# Altium project programmer.PrjPCB
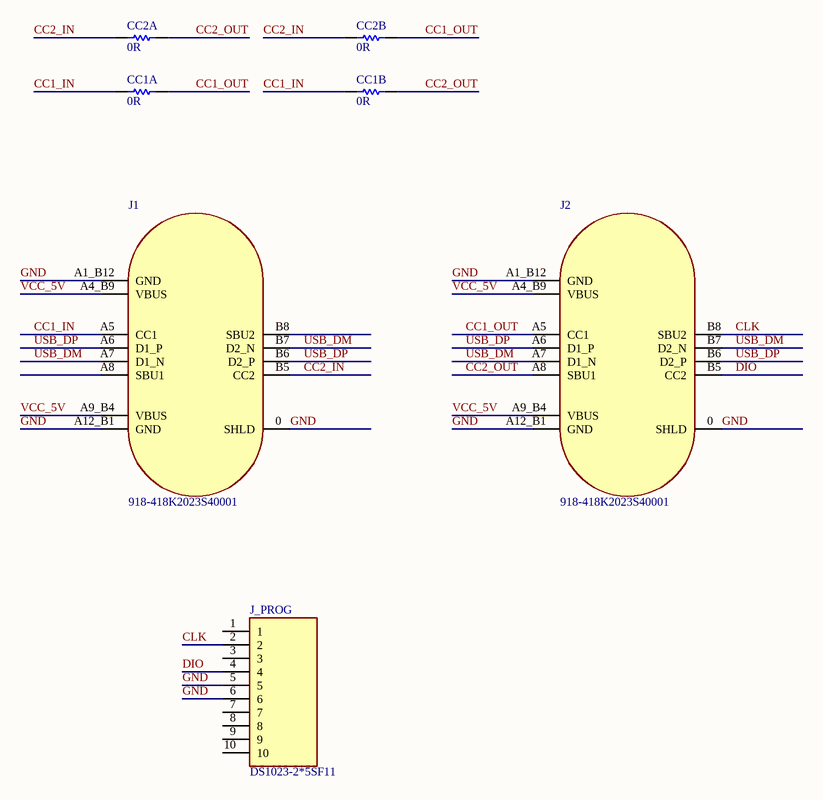
[diagram p0: programmer.SchDoc]
1 sheet, 7 parts. Net scope: global (net labels, ports and power ports of the same name join across sheets).
Board file: programmer.PcbDoc

## Sheet programmer.SchDoc
size A

### Parts
CC1A  value 0R  [R_0402]  (hidden comment: 0402WGF0000TCE)
CC1B  value 0R  [R_0402]  (hidden comment: 0402WGF0000TCE)
CC2A  value 0R  [R_0402]  (hidden comment: 0402WGF0000TCE)
CC2B  value 0R  [R_0402]  (hidden comment: 0402WGF0000TCE)
J1  918-418K2023S40001  [DX07S016JA1R1500]
J2  918-418K2023S40001  [DX07S016JA1R1500]
J_PROG  DS1023-2*5SF11  [HDR_FEM_2X5P]

### Nets
CC1_IN: CC1A.1 CC1B.1 J1.A5(CC1)
CC1_OUT: CC1A.2 CC2B.2 J2.A5(CC1)
CC2_IN: CC2A.1 CC2B.1 J1.B5(CC2)
CC2_OUT: CC1B.2 CC2A.2 J2.A8(SBU1)
CLK: J2.B8(SBU2) J_PROG.2
DIO: J2.B5(CC2) J_PROG.4
GND: J1.0(SHLD) J1.A1_B12(GND) J1.A12_B1(GND) J2.0(SHLD) J2.A1_B12(GND) J2.A12_B1(GND) J_PROG.5 J_PROG.6
USB_DM: J1.A7(D1_N) J1.B7(D2_N) J2.A7(D1_N) J2.B7(D2_N)
USB_DP: J1.A6(D1_P) J1.B6(D2_P) J2.A6(D1_P) J2.B6(D2_P)
VCC_5V: J1.A4_B9(VBUS) J1.A9_B4(VBUS) J2.A4_B9(VBUS) J2.A9_B4(VBUS)

Not connected (* = marked no-connect by the designer): J1 A8(SBU1) B8(SBU2); J_PROG 1 3 7 8 9 10

### Library data of the parts
CC1A CC1B CC2A CC2B = 0402WGF0000TCE: R - RESISTOR - SMD - 0R - 1% - 0402; LCSC Part #: C17168; JLC Availability: Basic
J1 J2 = 918-418K2023S40001: J - JACK - USB - Type C - Recepticle - SMT - 90°; JLC Availability: LCSC; LCSC Part #: C167321
J_PROG = DS1023-2*5SF11: J - JACK - PIN_HEADER 2X5P; LCSC Part #: C125068; JLC Availability: Extended

## Assembly variants
CONFIG1: not fitted CC1D CC1E CC2A CC2B CC2D CC2E